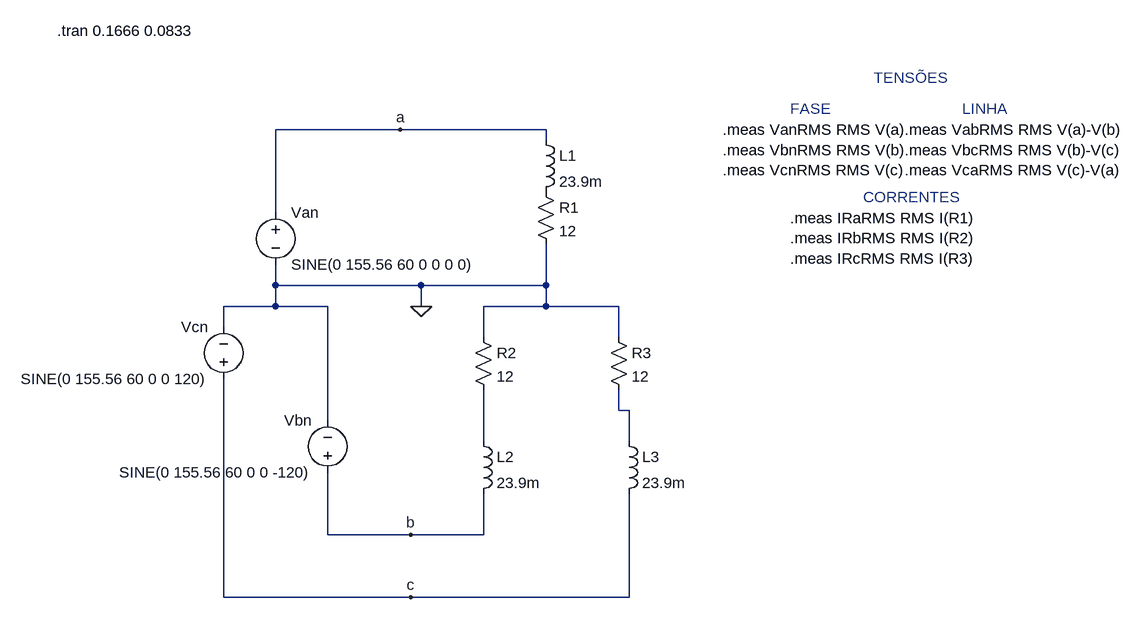
[diagram p0: schematic lab 32 .asc]
lab 32 .asc, the LTspice schematic file:
Version 4.1
SHEET 1 1332 700
WIRE 208 -64 16 -64
WIRE 432 -64 208 -64
WIRE 432 -48 432 -64
WIRE 16 64 16 -64
WIRE 16 176 16 144
WIRE 240 176 16 176
WIRE 432 176 432 112
WIRE 432 176 240 176
WIRE 16 208 16 176
WIRE 16 208 -64 208
WIRE 96 208 16 208
WIRE 240 208 240 176
WIRE 432 208 432 176
WIRE 432 208 336 208
WIRE 544 208 432 208
WIRE -64 240 -64 208
WIRE 336 256 336 208
WIRE 544 256 544 208
WIRE 544 368 544 336
WIRE 560 368 544 368
WIRE 96 384 96 208
WIRE 336 416 336 336
WIRE 560 416 560 368
WIRE 96 560 96 464
WIRE 224 560 96 560
WIRE 336 560 336 496
WIRE 336 560 224 560
WIRE -64 656 -64 320
WIRE 224 656 -64 656
WIRE 560 656 560 496
WIRE 560 656 224 656
FLAG 208 -64 a
FLAG 224 560 b
FLAG 224 656 c
FLAG 240 208 0
SYMBOL voltage 16 48 R0
WINDOW 123 0 0 Left 0
WINDOW 39 0 0 Left 0
SYMATTR InstName Van
SYMATTR Value SINE(0 155.56 60 0 0 0 0)
SYMBOL voltage 96 480 R180
WINDOW 0 24 96 Left 2
WINDOW 3 24 16 Left 2
WINDOW 123 0 0 Left 0
WINDOW 39 0 0 Left 0
SYMATTR InstName Vbn
SYMATTR Value SINE(0 155.56 60 0 0 -120)
SYMBOL voltage -64 336 R180
WINDOW 0 24 96 Left 2
WINDOW 3 24 16 Left 2
WINDOW 123 0 0 Left 0
WINDOW 39 0 0 Left 0
SYMATTR InstName Vcn
SYMATTR Value SINE(0 155.56 60 0 0 120)
SYMBOL res 416 16 R0
SYMATTR InstName R1
SYMATTR Value 12
SYMBOL res 320 240 R0
SYMATTR InstName R2
SYMATTR Value 12
SYMBOL res 528 240 R0
SYMATTR InstName R3
SYMATTR Value 12
SYMBOL ind 416 -64 R0
SYMATTR InstName L1
SYMATTR Value 23.9m
SYMBOL ind 320 400 R0
SYMATTR InstName L2
SYMATTR Value 23.9m
SYMBOL ind 544 400 R0
SYMATTR InstName L3
SYMATTR Value 23.9m
TEXT -320 -216 Left 2 !.tran 0.1666 0.0833
TEXT 704 -64 Left 2 !.meas VanRMS RMS V(a)\n.meas VbnRMS RMS V(b)\n.meas VcnRMS RMS V(c)
TEXT 936 -144 Left 2 ;TENSÕES
TEXT 808 -96 Left 2 ;FASE
TEXT 1072 -96 Left 2 ;LINHA
TEXT 984 -64 Left 2 !.meas VabRMS RMS V(a)-V(b)\n.meas VbcRMS RMS V(b)-V(c)\n.meas VcaRMS RMS V(c)-V(a)
TEXT 920 40 Left 2 ;CORRENTES
TEXT 808 72 Left 2 !.meas IRaRMS RMS I(R1)\n.meas IRbRMS RMS I(R2)\n.meas IRcRMS RMS I(R3)

The netlist it stands for:
* lab 32 .asc
Van a 0 SINE(0 155.56 60 0 0 0 0)
Vbn b 0 SINE(0 155.56 60 0 0 -120)
Vcn c 0 SINE(0 155.56 60 0 0 120)
R1 P001 0 12
R2 0 N002 12
R3 0 N001 12
L1 a P001 23.9m
L2 N002 b 23.9m
L3 N001 c 23.9m
.tran 0.1666 0.0833
.meas VanRMS RMS V(a)
.meas VbnRMS RMS V(b)
.meas VcnRMS RMS V(c)
* TENSÕES
* FASE
* LINHA
.meas VabRMS RMS V(a)-V(b)
.meas VbcRMS RMS V(b)-V(c)
.meas VcaRMS RMS V(c)-V(a)
* CORRENTES
.meas IRaRMS RMS I(R1)
.meas IRbRMS RMS I(R2)
.meas IRcRMS RMS I(R3)
.backanno
.end

* Results of the author's LTspice run, read from the files saved beside the schematic
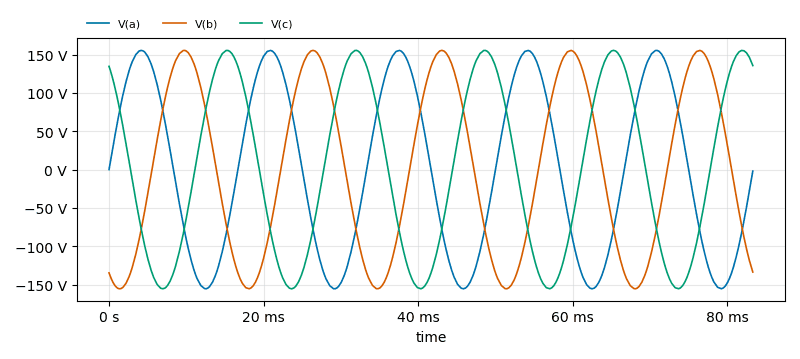
[diagram p1: Transient Analysis of lab 32 .asc, plotted from the saved traces]
* Transient Analysis, 1 run:
*   V(a): min -155.6 V, max 155.6 V, average 6.388 mV, rms 110 V, last -1.955 V
*   V(b): min -155.6 V, max 155.6 V, average 49.26 mV, rms 110 V, last -133.7 V
*   V(c): min -155.6 V, max 155.6 V, average -55.65 mV, rms 110 V, last 135.7 V
* From the log:
*   vanrms: RMS(V(a))=110.008997663 FROM 0 TO 0.0833
*   vbnrms: RMS(V(b))=109.976708614 FROM 0 TO 0.0833
*   vcnrms: RMS(V(c))=109.975128748 FROM 0 TO 0.0833
*   vabrms: RMS(V(a)-V(b))=190.523444923 FROM 0 TO 0.0833
*   vbcrms: RMS(V(b)-V(c))=190.464776451 FROM 0 TO 0.0833
*   vcarms: RMS(V(c)-V(a))=190.520709396 FROM 0 TO 0.0833
*   irarms: RMS(I(R1))=7.36077312777 FROM 0 TO 0.0833
*   irbrms: RMS(I(R2))=7.53648185688 FROM 0 TO 0.0833
*   ircrms: RMS(I(R3))=7.3500769268 FROM 0 TO 0.0833